# Altium schematic sheet SOC PINOUT.SchDoc
size A3; DocumentNumber: 12; SheetNumber: 12; SheetTotal: 12
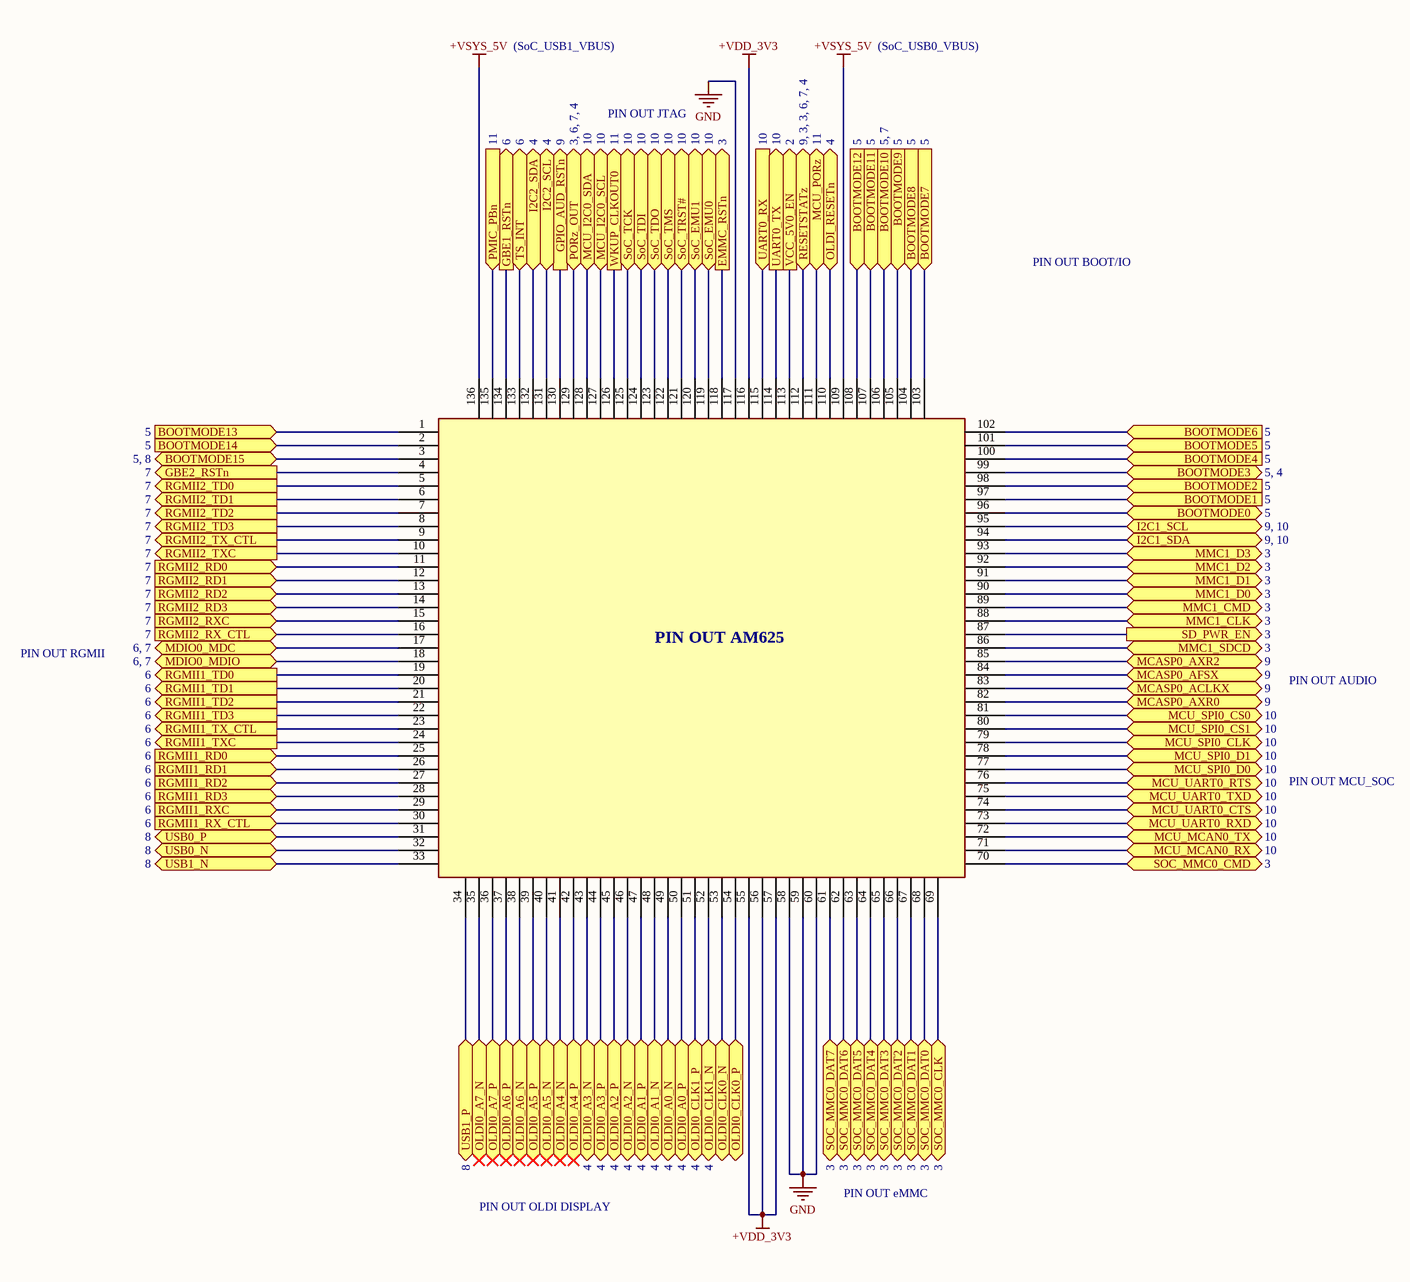
[diagram p0: SOC PINOUT.SchDoc]

## Parts
PIN1101  Pin OUT AM625  [PIN_OUT AM625 - 136PIN]  (value not drawn)  (no BOM)

## Ports
BOOTMODE0 (bidir, see 5), BOOTMODE1 (in, see 5), BOOTMODE2 (in, see 5), BOOTMODE3 (bidir, see 5, 4), BOOTMODE4 (in, see 5), BOOTMODE5 (in, see 5), BOOTMODE6 (in, see 5), BOOTMODE7 (in, see 5), BOOTMODE8 (in, see 5), BOOTMODE9 (in, see 5), BOOTMODE10 (in, see 5, 7), BOOTMODE11 (in, see 5), BOOTMODE12 (in, see 5), BOOTMODE13 (in, see 5), BOOTMODE14 (in, see 5), BOOTMODE15 (bidir, see 5, 8), EMMC_RSTn (out, see 3), GBE1_RSTn (out, see 6), GBE2_RSTn (out, see 7), GPIO_AUD_RSTn (out, see 9), I2C1_SCL (bidir, see 9, 10), I2C1_SDA (bidir, see 9, 10), I2C2_SCL (bidir, see 4), I2C2_SDA (bidir, see 4), MCASP0_ACLKX (bidir, see 9), MCASP0_AFSX (bidir, see 9), MCASP0_AXR0 (bidir, see 9), MCASP0_AXR2 (bidir, see 9), MCU_I2C0_SCL (bidir, see 10), MCU_I2C0_SDA (bidir, see 10), MCU_MCAN0_RX (bidir, see 10), MCU_MCAN0_TX (bidir, see 10), MCU_PORz (bidir, see 11), MCU_SPI0_CLK (bidir, see 10), MCU_SPI0_CS0 (bidir, see 10), MCU_SPI0_CS1 (bidir, see 10), MCU_SPI0_D0 (bidir, see 10), MCU_SPI0_D1 (bidir, see 10), MCU_UART0_CTS (bidir, see 10), MCU_UART0_RTS (bidir, see 10), MCU_UART0_RXD (bidir, see 10), MCU_UART0_TXD (bidir, see 10), MDIO0_MDC (bidir, see 6, 7), MDIO0_MDIO (bidir, see 6, 7), MMC1_CLK (bidir, see 3), MMC1_CMD (bidir, see 3), MMC1_D0 (bidir, see 3), MMC1_D1 (bidir, see 3), MMC1_D2 (bidir, see 3), MMC1_D3 (bidir, see 3), MMC1_SDCD (bidir, see 3), OLDI0_A0_N (bidir, see 4), OLDI0_A0_P (bidir, see 4), OLDI0_A1_N (bidir, see 4), OLDI0_A1_P (bidir, see 4), OLDI0_A2_N (bidir, see 4), OLDI0_A2_P (bidir, see 4), OLDI0_A3_N (bidir, see 4), OLDI0_A3_P (bidir, see 4), OLDI0_A4_N (bidir), OLDI0_A4_P (bidir), OLDI0_A5_N (bidir), OLDI0_A5_P (bidir), OLDI0_A6_N (bidir), OLDI0_A6_P (bidir), OLDI0_A7_N (bidir), OLDI0_A7_P (bidir), OLDI0_CLK0_N (bidir), OLDI0_CLK0_P (bidir), OLDI0_CLK1_N (bidir, see 4), OLDI0_CLK1_P (bidir, see 4), OLDI_RESETn (bidir, see 4), PMIC_PBn (in, see 11), PORz_OUT (bidir, see 3, 6, 7, 4), RESETSTATz (bidir, see 9, 3, 3, 6, 7, 4), RGMII1_RD0 (in, see 6), RGMII1_RD1 (in, see 6), RGMII1_RD2 (in, see 6), RGMII1_RD3 (in, see 6), RGMII1_RX_CTL (in, see 6), RGMII1_RXC (in, see 6), RGMII1_TD0 (out, see 6), RGMII1_TD1 (out, see 6), RGMII1_TD2 (out, see 6), RGMII1_TD3 (out, see 6), RGMII1_TX_CTL (out, see 6), RGMII1_TXC (out, see 6), RGMII2_RD0 (in, see 7), RGMII2_RD1 (in, see 7), RGMII2_RD2 (in, see 7), RGMII2_RD3 (in, see 7), RGMII2_RX_CTL (in, see 7), RGMII2_RXC (in, see 7), RGMII2_TD0 (out, see 7), RGMII2_TD1 (out, see 7), RGMII2_TD2 (out, see 7), RGMII2_TD3 (out, see 7), RGMII2_TX_CTL (out, see 7), RGMII2_TXC (out, see 7), SD_PWR_EN (out, see 3), SoC_EMU0 (bidir, see 10), SoC_EMU1 (bidir, see 10), SOC_MMC0_CLK (bidir, see 3), SOC_MMC0_CMD (bidir, see 3), SOC_MMC0_DAT0 (bidir, see 3), SOC_MMC0_DAT1 (bidir, see 3), SOC_MMC0_DAT2 (bidir, see 3), SOC_MMC0_DAT3 (bidir, see 3), SOC_MMC0_DAT4 (bidir, see 3), SOC_MMC0_DAT5 (bidir, see 3), SOC_MMC0_DAT6 (bidir, see 3), SOC_MMC0_DAT7 (bidir, see 3), SoC_TCK (bidir, see 10), SoC_TDI (bidir, see 10), SoC_TDO (bidir, see 10), SoC_TMS (bidir, see 10), SoC_TRST# (bidir, see 10), TS_INT (bidir, see 6), UART0_RX (in, see 10), UART0_TX (out, see 10), USB0_N (bidir, see 8), USB0_P (bidir, see 8), USB1_N (bidir, see 8), USB1_P (bidir, see 8), VCC_5V0_EN (out, see 2), WKUP_CLKOUT0 (out, see 11)

## Nets
+VDD_3V3: PIN1101.55 PIN1101.56 PIN1101.57 PIN1101.116
+VSYS_5V: PIN1101.109 PIN1101.136
GND: PIN1101.58 PIN1101.59 PIN1101.60 PIN1101.117
BOOTMODE0: PIN1101.96 ; port BOOTMODE0
BOOTMODE1: PIN1101.97 ; port BOOTMODE1
BOOTMODE2: PIN1101.98 ; port BOOTMODE2
BOOTMODE3: PIN1101.99 ; port BOOTMODE3
BOOTMODE4: PIN1101.100 ; port BOOTMODE4
BOOTMODE5: PIN1101.101 ; port BOOTMODE5
BOOTMODE6: PIN1101.102 ; port BOOTMODE6
BOOTMODE7: PIN1101.103 ; port BOOTMODE7
BOOTMODE8: PIN1101.104 ; port BOOTMODE8
BOOTMODE9: PIN1101.105 ; port BOOTMODE9
BOOTMODE10: PIN1101.106 ; port BOOTMODE10
BOOTMODE11: PIN1101.107 ; port BOOTMODE11
BOOTMODE12: PIN1101.108 ; port BOOTMODE12
BOOTMODE13: PIN1101.1 ; port BOOTMODE13
BOOTMODE14: PIN1101.2 ; port BOOTMODE14
BOOTMODE15: PIN1101.3 ; port BOOTMODE15
EMMC_RSTn: PIN1101.118 ; port EMMC_RSTn
GBE1_RSTn: PIN1101.134 ; port GBE1_RSTn
GBE2_RSTn: PIN1101.4 ; port GBE2_RSTn
GPIO_AUD_RSTn: PIN1101.130 ; port GPIO_AUD_RSTn
I2C1_SCL: PIN1101.95 ; port I2C1_SCL
I2C1_SDA: PIN1101.94 ; port I2C1_SDA
I2C2_SCL: PIN1101.131 ; port I2C2_SCL
I2C2_SDA: PIN1101.132 ; port I2C2_SDA
MCASP0_ACLKX: PIN1101.83 ; port MCASP0_ACLKX
MCASP0_AFSX: PIN1101.84 ; port MCASP0_AFSX
MCASP0_AXR0: PIN1101.82 ; port MCASP0_AXR0
MCASP0_AXR2: PIN1101.85 ; port MCASP0_AXR2
MCU_I2C0_SCL: PIN1101.127 ; port MCU_I2C0_SCL
MCU_I2C0_SDA: PIN1101.128 ; port MCU_I2C0_SDA
MCU_MCAN0_RX: PIN1101.71 ; port MCU_MCAN0_RX
MCU_MCAN0_TX: PIN1101.72 ; port MCU_MCAN0_TX
MCU_PORz: PIN1101.111 ; port MCU_PORz
MCU_SPI0_CLK: PIN1101.79 ; port MCU_SPI0_CLK
MCU_SPI0_CS0: PIN1101.81 ; port MCU_SPI0_CS0
MCU_SPI0_CS1: PIN1101.80 ; port MCU_SPI0_CS1
MCU_SPI0_D0: PIN1101.77 ; port MCU_SPI0_D0
MCU_SPI0_D1: PIN1101.78 ; port MCU_SPI0_D1
MCU_UART0_CTS: PIN1101.74 ; port MCU_UART0_CTS
MCU_UART0_RTS: PIN1101.76 ; port MCU_UART0_RTS
MCU_UART0_RXD: PIN1101.73 ; port MCU_UART0_RXD
MCU_UART0_TXD: PIN1101.75 ; port MCU_UART0_TXD
MDIO0_MDC: PIN1101.17 ; port MDIO0_MDC
MDIO0_MDIO: PIN1101.18 ; port MDIO0_MDIO
MMC1_CLK: PIN1101.88 ; port MMC1_CLK
MMC1_CMD: PIN1101.89 ; port MMC1_CMD
MMC1_D0: PIN1101.90 ; port MMC1_D0
MMC1_D1: PIN1101.91 ; port MMC1_D1
MMC1_D2: PIN1101.92 ; port MMC1_D2
MMC1_D3: PIN1101.93 ; port MMC1_D3
MMC1_SDCD: PIN1101.86 ; port MMC1_SDCD
OLDI0_A0_N: PIN1101.49 ; port OLDI0_A0_N
OLDI0_A0_P: PIN1101.50 ; port OLDI0_A0_P
OLDI0_A1_N: PIN1101.48 ; port OLDI0_A1_N
OLDI0_A1_P: PIN1101.47 ; port OLDI0_A1_P
OLDI0_A2_N: PIN1101.46 ; port OLDI0_A2_N
OLDI0_A2_P: PIN1101.45 ; port OLDI0_A2_P
OLDI0_A3_N: PIN1101.43 ; port OLDI0_A3_N
OLDI0_A3_P: PIN1101.44 ; port OLDI0_A3_P
OLDI0_A4_N: PIN1101.41 ; port OLDI0_A4_N
OLDI0_A4_P: PIN1101.42 ; port OLDI0_A4_P
OLDI0_A5_N: PIN1101.40 ; port OLDI0_A5_N
OLDI0_A5_P: PIN1101.39 ; port OLDI0_A5_P
OLDI0_A6_N: PIN1101.38 ; port OLDI0_A6_N
OLDI0_A6_P: PIN1101.37 ; port OLDI0_A6_P
OLDI0_A7_N: PIN1101.35 ; port OLDI0_A7_N
OLDI0_A7_P: PIN1101.36 ; port OLDI0_A7_P
OLDI0_CLK0_N: PIN1101.53 ; port OLDI0_CLK0_N
OLDI0_CLK0_P: PIN1101.54 ; port OLDI0_CLK0_P
OLDI0_CLK1_N: PIN1101.52 ; port OLDI0_CLK1_N
OLDI0_CLK1_P: PIN1101.51 ; port OLDI0_CLK1_P
OLDI_RESETn: PIN1101.110 ; port OLDI_RESETn
PMIC_PBn: PIN1101.135 ; port PMIC_PBn
PORz_OUT: PIN1101.129 ; port PORz_OUT
RESETSTATz: PIN1101.112 ; port RESETSTATz
RGMII1_RD0: PIN1101.25 ; port RGMII1_RD0
RGMII1_RD1: PIN1101.26 ; port RGMII1_RD1
RGMII1_RD2: PIN1101.27 ; port RGMII1_RD2
RGMII1_RD3: PIN1101.28 ; port RGMII1_RD3
RGMII1_RX_CTL: PIN1101.30 ; port RGMII1_RX_CTL
RGMII1_RXC: PIN1101.29 ; port RGMII1_RXC
RGMII1_TD0: PIN1101.19 ; port RGMII1_TD0
RGMII1_TD1: PIN1101.20 ; port RGMII1_TD1
RGMII1_TD2: PIN1101.21 ; port RGMII1_TD2
RGMII1_TD3: PIN1101.22 ; port RGMII1_TD3
RGMII1_TX_CTL: PIN1101.23 ; port RGMII1_TX_CTL
RGMII1_TXC: PIN1101.24 ; port RGMII1_TXC
RGMII2_RD0: PIN1101.11 ; port RGMII2_RD0
RGMII2_RD1: PIN1101.12 ; port RGMII2_RD1
RGMII2_RD2: PIN1101.13 ; port RGMII2_RD2
RGMII2_RD3: PIN1101.14 ; port RGMII2_RD3
RGMII2_RX_CTL: PIN1101.16 ; port RGMII2_RX_CTL
RGMII2_RXC: PIN1101.15 ; port RGMII2_RXC
RGMII2_TD0: PIN1101.5 ; port RGMII2_TD0
RGMII2_TD1: PIN1101.6 ; port RGMII2_TD1
RGMII2_TD2: PIN1101.7 ; port RGMII2_TD2
RGMII2_TD3: PIN1101.8 ; port RGMII2_TD3
RGMII2_TX_CTL: PIN1101.9 ; port RGMII2_TX_CTL
RGMII2_TXC: PIN1101.10 ; port RGMII2_TXC
SD_PWR_EN: PIN1101.87 ; port SD_PWR_EN
SoC_EMU0: PIN1101.119 ; port SoC_EMU0
SoC_EMU1: PIN1101.120 ; port SoC_EMU1
SOC_MMC0_CLK: PIN1101.69 ; port SOC_MMC0_CLK
SOC_MMC0_CMD: PIN1101.70 ; port SOC_MMC0_CMD
SOC_MMC0_DAT0: PIN1101.68 ; port SOC_MMC0_DAT0
SOC_MMC0_DAT1: PIN1101.67 ; port SOC_MMC0_DAT1
SOC_MMC0_DAT2: PIN1101.66 ; port SOC_MMC0_DAT2
SOC_MMC0_DAT3: PIN1101.65 ; port SOC_MMC0_DAT3
SOC_MMC0_DAT4: PIN1101.64 ; port SOC_MMC0_DAT4
SOC_MMC0_DAT5: PIN1101.63 ; port SOC_MMC0_DAT5
SOC_MMC0_DAT6: PIN1101.62 ; port SOC_MMC0_DAT6
SOC_MMC0_DAT7: PIN1101.61 ; port SOC_MMC0_DAT7
SoC_TCK: PIN1101.125 ; port SoC_TCK
SoC_TDI: PIN1101.124 ; port SoC_TDI
SoC_TDO: PIN1101.123 ; port SoC_TDO
SoC_TMS: PIN1101.122 ; port SoC_TMS
SoC_TRST#: PIN1101.121 ; port SoC_TRST#
TS_INT: PIN1101.133 ; port TS_INT
UART0_RX: PIN1101.115 ; port UART0_RX
UART0_TX: PIN1101.114 ; port UART0_TX
USB0_N: PIN1101.32 ; port USB0_N
USB0_P: PIN1101.31 ; port USB0_P
USB1_N: PIN1101.33 ; port USB1_N
USB1_P: PIN1101.34 ; port USB1_P
VCC_5V0_EN: PIN1101.113 ; port VCC_5V0_EN
WKUP_CLKOUT0: PIN1101.126 ; port WKUP_CLKOUT0

## Notes on the sheet
- (SoC_USB1_VBUS)
- (SoC_USB0_VBUS)
- PIN OUT JTAG
- PIN OUT BOOT/IO
- PIN OUT RGMII
- PIN OUT AUDIO
- PIN OUT MCU_SOC
- PIN OUT OLDI DISPLAY
- PIN OUT eMMC
- (in symbol PIN_OUT) PIN OUT AM625

## Library data of the parts
PIN1101 = PIN_OUT